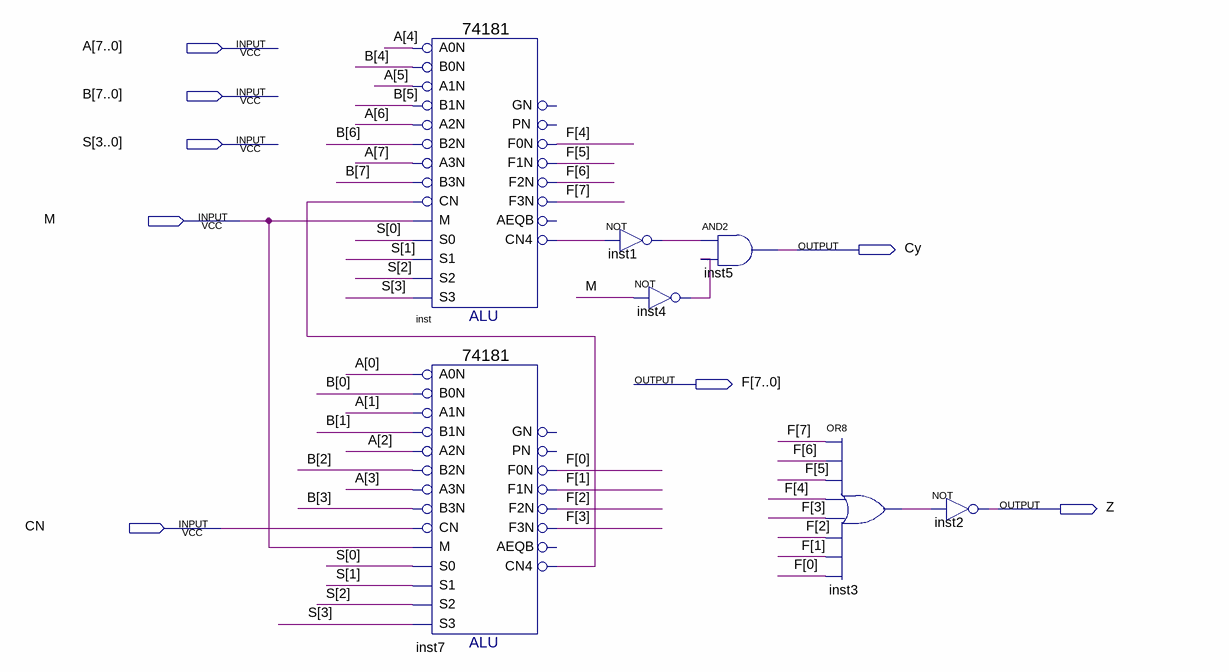
[diagram p0: schematic sheet]
// Quartus schematic alu.bdf as structural Verilog: 7 symbols, 8 pins
module alu (
  input  [7:0] A,
  input  [7:0] B,
  input  [3:0] S,
  input  M,
  input  CN,
  output Cy,
  output [7:0] F,
  output Z
);

  wire inst1_out, inst3_out, inst4_out, inst7_cn4, inst_cn4;

  \74181  inst (
    .B0N(B[4]), .A0N(A[4]), .A1N(A[5]), .B1N(B[5]), .A3N(A[7]), .B2N(B[6]), .A2N(A[6]), .M(M),
    .CN(inst7_cn4), .B3N(B[7]), .S2(S[2]), .S1(S[1]), .S0(S[0]), .S3(S[3]), .F3N(F[7]), .F1N(F[5]),
    .F0N(F[4]), .CN4(inst_cn4), .F2N(F[6]));  // open: PN, GN, AEQB
  \74181  inst7 (
    .B0N(B[0]), .A0N(A[0]), .A1N(A[1]), .B1N(B[1]), .A3N(A[3]), .B2N(B[2]), .A2N(A[2]), .M(M), .CN(CN),
    .B3N(B[3]), .S2(S[2]), .S1(S[1]), .S0(S[0]), .S3(S[3]), .F3N(F[3]), .F1N(F[1]), .F0N(F[0]),
    .CN4(inst7_cn4), .F2N(F[2]));  // open: PN, GN, AEQB
  not inst1 (inst1_out, inst_cn4);
  not inst4 (inst4_out, M);
  and inst5 (Cy, inst1_out, inst4_out);
  or inst3 (inst3_out, F[7], F[6], F[5], F[4], F[3], F[2], F[1], F[0]);
  not inst2 (Z, inst3_out);
endmodule
